# EAGLE schematic KKK_valdiklis_v3 (EAGLE 6.4)
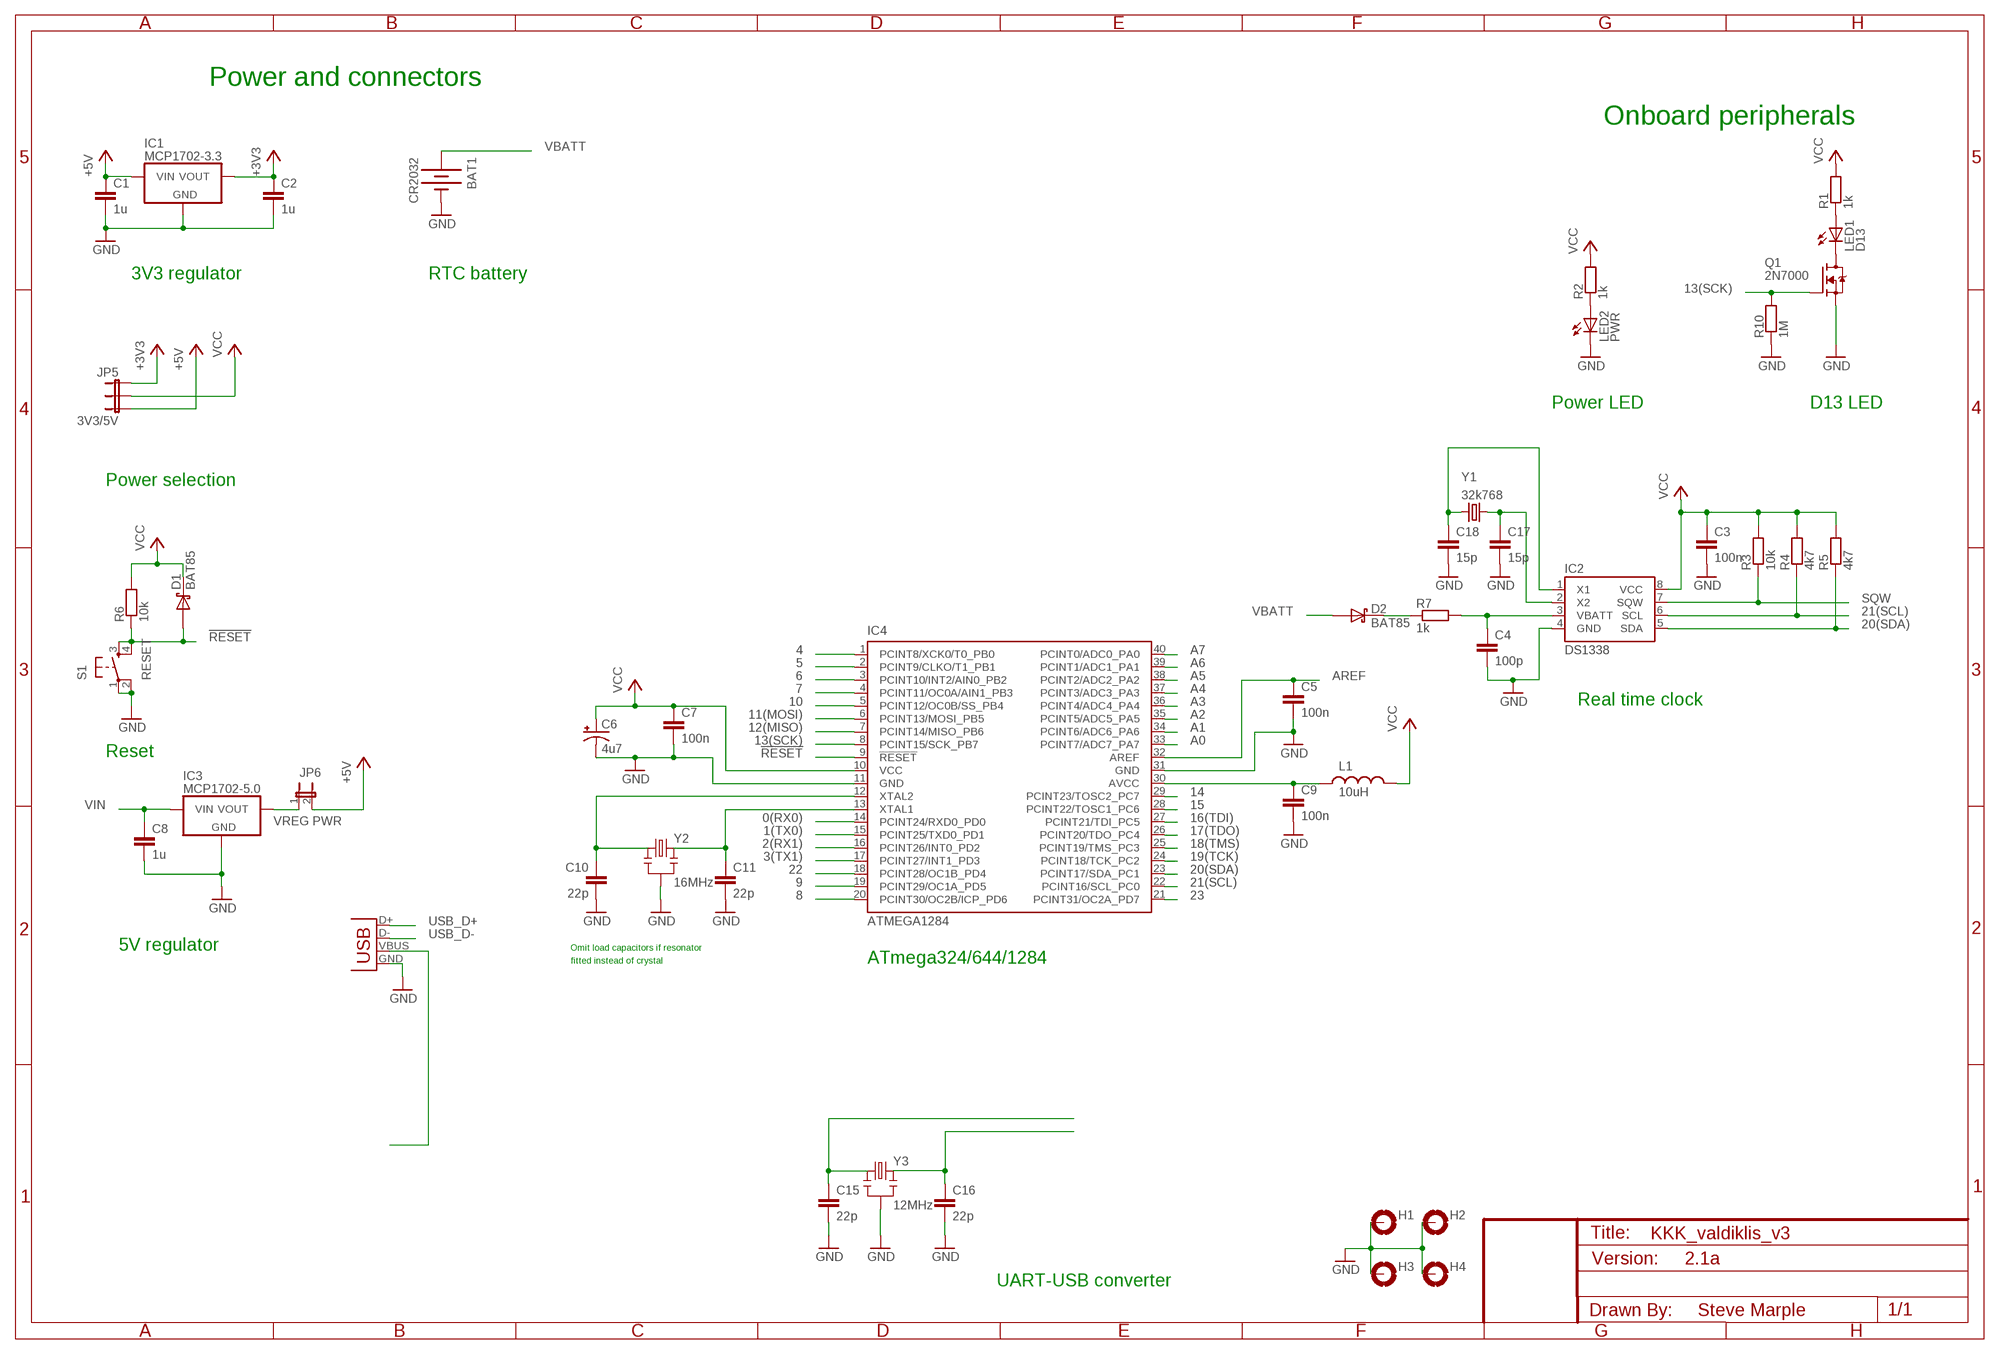
[diagram p0: schematic, sheet 1]

## Parts
BAT1  CR2032  BATTERY20PTH  [BATTCOM_20MM_PTH]
C1  1u  CAPPTH1  [CAP-PTH-5MM]
C2  1u  CAPPTH1  [CAP-PTH-5MM]
C3  100n  CAPPTH  [CAP-PTH-SMALL]
C4  100p  CAPPTH  [CAP-PTH-SMALL]
C5  100n  CAPPTH  [CAP-PTH-SMALL]
C6  4u7  CAP_POLPTH2  [CPOL-RADIAL-10UF-25V]
C7  100n  CAPPTH  [CAP-PTH-SMALL]
C8  1u  CAPPTH1  [CAP-PTH-5MM]
C9  100n  CAPPTH  [CAP-PTH-SMALL]
C10  22p  CAPPTH  [CAP-PTH-SMALL]
C11  22p  CAPPTH  [CAP-PTH-SMALL]
C15  22p  CAPPTH  [CAP-PTH-SMALL]
C16  22p  CAPPTH  [CAP-PTH-SMALL]
C17  15p  CAPPTH  [CAP-PTH-SMALL]
C18  15p  CAPPTH  [CAP-PTH-SMALL]
D1  BAT85  DIODE-SCHOTTKY  [DIODE-TH-0.4]
D2  BAT85  DIODE-SCHOTTKY  [DIODE-TH-0.4]
H1  MOUNT-PAD-ROUND3.0  [3,0-PAD]
H2  MOUNT-PAD-ROUND3.0  [3,0-PAD]
H3  MOUNT-PAD-ROUND3.0  [3,0-PAD]
H4  MOUNT-PAD-ROUND3.0  [3,0-PAD]
IC1  MCP1702-3.3  MCP1702  [TO-92]
IC2  DS1338  DS1307SO08  [SO08]
IC3  MCP1702-5.0  MCP1702  [TO-92]
IC4  ATMEGA1284  ATMEGA644-20PU  [DIL40]
JP5  3V3/5V  JUMPER-3PTH  [1X03]
JP6  VREG PWR  JUMPER-2PTH  [1X02]
L1  10uH  INDUCTOR0.4"-AXIAL  [RES-AXIAL-0.4]
LED1  D13  LED3MM  [LED3MM]
LED2  PWR  LED3MM  [LED3MM]
Q1  2N7000  [TO-92]
R1  1k  RESISTOR  [RES-AXIAL-0.4]
R2  1k  RESISTOR  [RES-AXIAL-0.4]
R3  10k  RESISTOR  [RES-AXIAL-0.4]
R4  4k7  RESISTOR  [RES-AXIAL-0.4]
R5  4k7  RESISTOR  [RES-AXIAL-0.4]
R6  10k  RESISTOR  [RES-AXIAL-0.4]
R7  1k  RESISTOR  [RES-AXIAL-0.4]
R10  1M  RESISTOR  [RES-AXIAL-0.4]
S1  RESET  TAC_SWITCHPTH  [TACTILE-PTH]
X3  USB  USBPTH  [USB-B-PTH]
Y1  32k768  CRYSTALTC38H  [TC38H]
Y2  16MHz  CRYSTAL-RESONATOR  [HC49U-V-RESONATOR]
Y3  12MHz  CRYSTAL-RESONATOR  [HC49U-V-RESONATOR]

## Nets
0(RX0): IC4.14(PCINT24/RXD0_PD0)
1(TX0): IC4.15(PCINT25/TXD0_PD1)
2(RX1): IC4.16(PCINT26/INT0_PD2)
3(TX1): IC4.17(PCINT27/INT1_PD3)
4: IC4.1(PCINT8/XCK0/T0_PB0)
5: IC4.2(PCINT9/CLKO/T1_PB1)
6: IC4.3(PCINT10/INT2/AIN0_PB2)
7: IC4.4(PCINT11/OC0A/AIN1_PB3)
8: IC4.20(PCINT30/OC2B/ICP_PD6)
9: IC4.19(PCINT29/OC1A_PD5)
10: IC4.5(PCINT12/OC0B/SS_PB4)
11(MOSI): IC4.6(PCINT13/MOSI_PB5)
12(MISO): IC4.7(PCINT14/MISO_PB6)
13(SCK): IC4.8(PCINT15/SCK_PB7) Q1.2(G) R10.P$2
14: IC4.29(PCINT23/TOSC2_PC7)
15: IC4.28(PCINT22/TOSC1_PC6)
16(TDI): IC4.27(PCINT21/TDI_PC5)
17(TDO): IC4.26(PCINT20/TDO_PC4)
18(TMS): IC4.25(PCINT19/TMS_PC3)
19(TCK): IC4.24(PCINT18/TCK_PC2)
20(SDA): IC2.5(SDA) IC4.23(PCINT17/SDA_PC1) R5.P$1
21(SCL): IC2.6(SCL) IC4.22(PCINT16/SCL_PC0) R4.P$1
22: IC4.18(PCINT28/OC1B_PD4)
23: IC4.21(PCINT31/OC2A_PD7)
!RESET: D1.A IC4.9(!RESET) R6.P$1 S1.3 S1.4
+3V3 [power]: C2.1 IC1.3(VOUT) JP5.1
+5V [power]: C1.1 IC1.2(VIN) JP5.3 JP6.2
A0: IC4.33(PCINT7/ADC7_PA7)
A1: IC4.34(PCINT6/ADC6_PA6)
A2: IC4.35(PCINT5/ADC5_PA5)
A3: IC4.36(PCINT4/ADC4_PA4)
A4: IC4.37(PCINT3/ADC3_PA3)
A5: IC4.38(PCINT2/ADC2_PA2)
A6: IC4.39(PCINT1/ADC1_PA1)
A7: IC4.40(PCINT0/ADC0_PA0)
AREF: C5.1 IC4.32(AREF)
AVCC [power]: C9.1 IC4.30(AVCC) L1.P$1
GND [power]: BAT1.2(-) C1.2 C2.2 C3.2 C4.2 C5.2 C6.2(-) C7.2 C8.2 C9.2 C10.2 C11.2 C15.2 C16.2 C17.2 C18.2 H1.B3,0(MOUNT) H2.B3,0(MOUNT) H3.B3,0(MOUNT) H4.B3,0(MOUNT) IC1.1(GND) IC2.4(GND) IC3.1(GND) IC4.11(GND) IC4.31(GND) LED2.K(C) Q1.1(S) R10.P$1 S1.1 S1.2 X3.GND Y2.GND Y3.GND
N$1: C11.1 IC4.13(XTAL1) Y2.2
N$2: C10.1 IC4.12(XTAL2) Y2.1
N$3: LED1.A R1.P$1
N$4: LED1.K(C) Q1.3(D)
N$5: C18.1 IC2.1(X1) Y1.2
N$7: C16.1 Y3.2
N$8: LED2.A R2.P$1
N$9: D2.C R7.P$1
N$11: C4.1 IC2.3(VBATT) R7.P$2
N$12: C17.1 IC2.2(X2) Y1.1
N$14: IC3.3(VOUT) JP6.1
N$16 [power]: X3.VBUS
N$18: C15.1 Y3.1
SQW: IC2.7(SQW) R3.P$1
USB_D+: X3.D+
USB_D-: X3.D-
VBATT: BAT1.1(+) D2.A
VCC [power]: C3.1 C6.1(+) C7.1 D1.C IC2.8(VCC) IC4.10(VCC) JP5.2 L1.P$2 R1.P$2 R2.P$2 R3.P$2 R4.P$2 R5.P$2 R6.P$2
VIN [power]: C8.1 IC3.2(VIN)

## Notes on the sheet
- Power and connectors
- Onboard peripherals
- 3V3 regulator | RTC battery
- Power LED | D13 LED
- Power selection
- Real time clock
- Reset
- 5V regulator | Omit load capacitors if resonator
- fitted instead of crystal | ATmega324/644/1284
- 2.1a
- UART-USB converter
- Steve Marple

## Library data of the parts
BAT1 = SparkFun:BATTERY: Battery Holders Various common sizes : AA, AAA, 20mm coin cell and 12mm coin cell.
C1-C5 C7-C9 C15-C18 = SparkFun:CAP: Capacitor Standard 0603 ceramic capacitor, and 0.1" leaded capacitor.
C6 = SparkFun:CAP_POL: Capacitor Polarized These are standard SMD and PTH capacitors. Normally 10uF, 47uF, and 100uF in electrolytic and tantalum varieties. Always verify the external diameter of the through hole cap, it varies with capacity, voltage, and manufacturer. The EIA devices should be standard.
C10 C11 = SparkFun:CAP: Capacitor Standard 0603 ceramic capacitor, and 0.1" leaded capacitor.; OPTION: Do not fit for ceramic resonator
D1 D2 = SteveMarple:DIODE-SCHOTTKY
H1-H4 = holes:MOUNT-PAD-ROUND: MOUNTING PAD, round
IC1 IC3 = SteveMarple:MCP1702: Microchip MCP1702 250mA loq quiescent current (2uA) LDO voltage regulator.
IC2 = SteveMarple:DS1307
IC4 = SteveMarple:ATMEGA644-*PU: 8-bit Microcontroller with 64K Bytes In-System Programmable Flash Auto generated by make-symbol-device-package-bsdl.ulp Rev. 34 Source: http://www.atmel.com/dyn/resources/prod_documents/doc2593.pdf; MPN: ATMEGA644-20PU; OC_FARNELL: 1288340; OC_NEWARK: 23M5060
JP5 = SparkFun:JUMPER-3
JP6 = SparkFun:JUMPER-2: Jumper Basic 0.1" spaced jumper. Use with breakaway headers.
L1 = SteveMarple:INDUCTOR: Inductors Basic Inductor/Choke - 0603 and 1206. Footprints are not proven and vary greatly between part numbers.
LED1 LED2 = SparkFun:LED: LEDs Standard schematic elements and footprints for 5mm, 3mm, 1206, and 0603 sized LEDs. 5mm - Spark Fun Electronics SKU : COM-00529 (and others)
Q1 = SteveMarple:2N7000: 2N7000 FET
R1-R7 R10 = SteveMarple:RESISTOR: 1/4W PTH resistor
S1 = SparkFun:TAC_SWITCH: Momentary Switch Button commonly used for reset or general input. Spark Fun Electronics SKU : COM-00097
X3 = SteveMarple:USB: USB Connectors USB-B-PTH is fully proven SKU : PRT-00139 USB-miniB is fully proven SKU : PRT-00587 USB-A-PCB is untested. USB-A-H is throughly reviewed, but untested. Spark Fun Electronics SKU : PRT-00437 USB-B-SMT is throughly reviewed, but untested. Needs silkscreen touching up. USB-A-S has not been used/tested USB-MB-H has not been used/tested
Y1 = SteveMarple:CRYSTAL: Crystals Various standard crystals. Proven footprints. Spark Fun Electronics SKU : COM-00534
Y2 Y3 = SteveMarple:CRYSTAL-RESONATOR: Crystal/resonator; OPTION: Crystal or ceramic resonator. Max 12MHz for 3V3 operation.

## Net classes
1 power: width 0.381 mm
3 antenna: width 0.61 mm